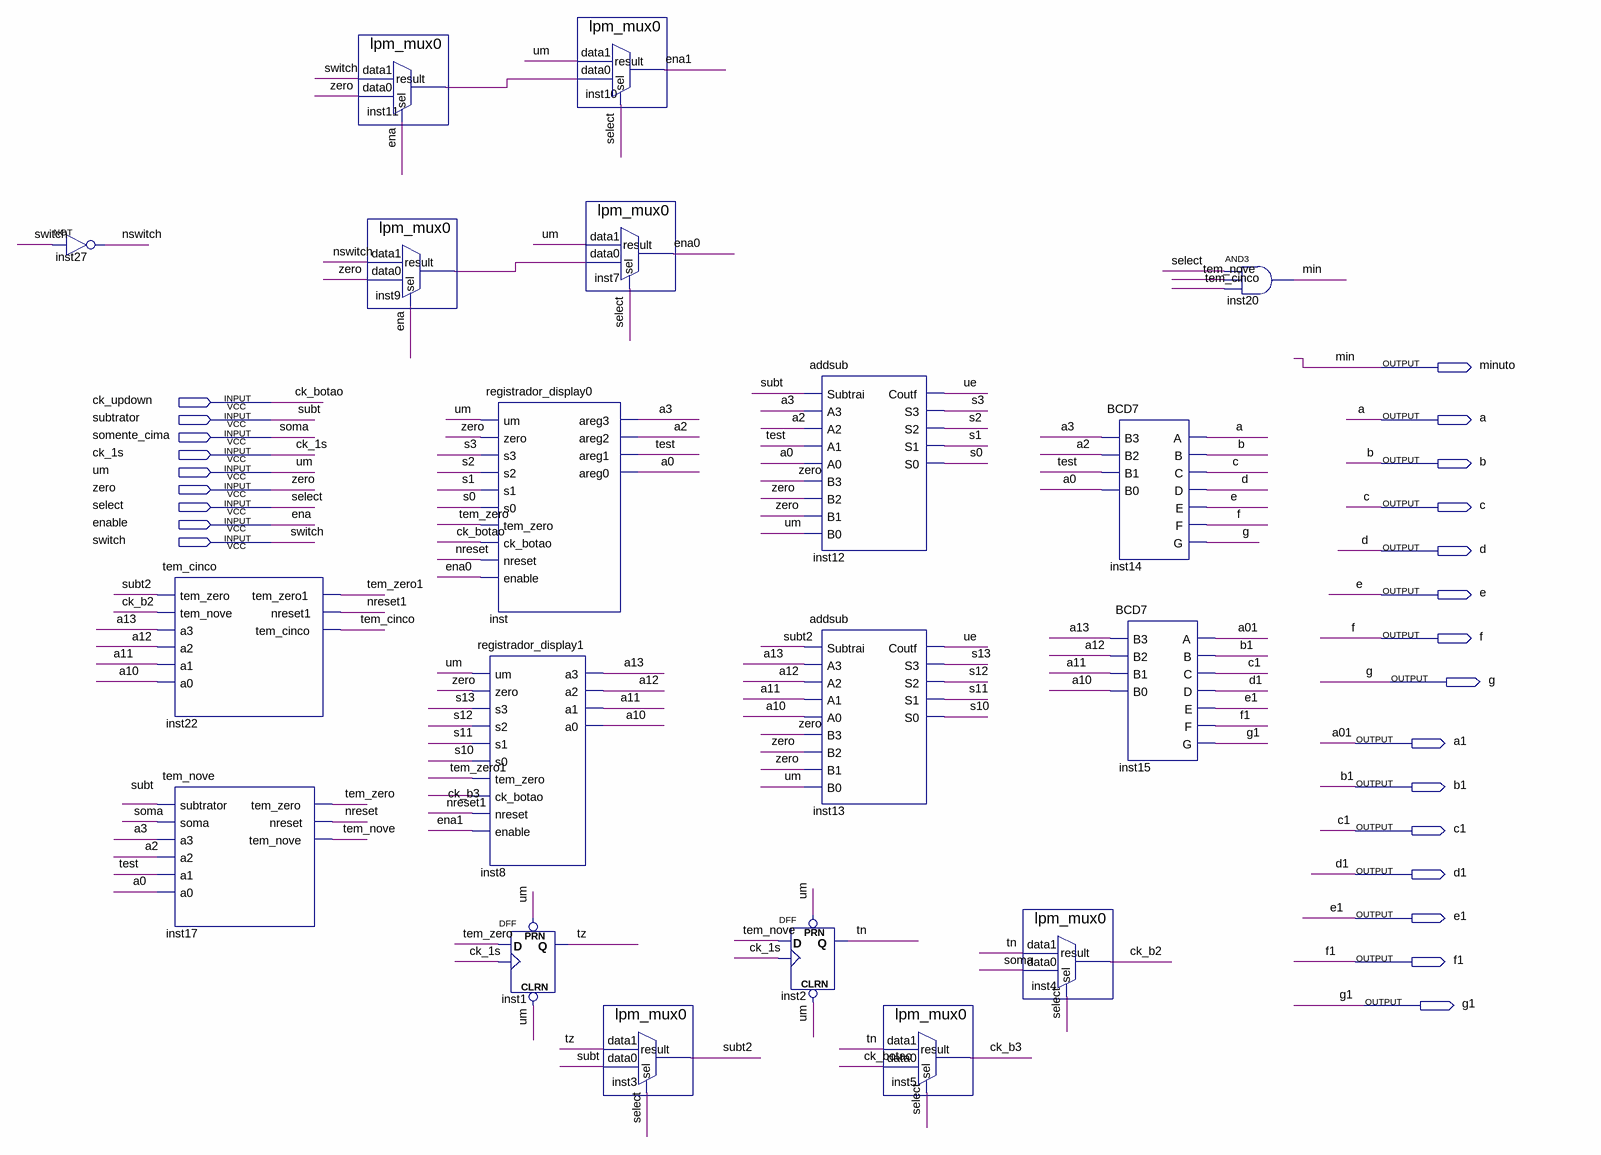
[diagram p0: schematic sheet]
// Quartus schematic display_segundos.bdf as structural Verilog: 19 symbols, 24 pins
module display_segundos (
  input  ck_updown,
  input  subtrator,
  input  somente_cima,
  input  ck_1s,
  input  um,
  input  zero,
  input  select,
  input  enable,
  input  switch,
  output minuto,
  output a,
  output b,
  output c,
  output d,
  output e,
  output f,
  output g,
  output a1,
  output b1,
  output c1,
  output d1,
  output e1,
  output f1,
  output g1
);

  wire a0, a2, a3, a10, a11, a12, a13, ck_b2, ck_b3, ena0, ena1, inst9_result, inst11_result, nreset,
       nreset1, nswitch, s0, s1, s2, s3, s10, s11, s12, s13, subt2, tem_cinco, tem_nove, tem_zero, tem_zero1,
       test, tn, tz, ue;

  not inst27 (nswitch, switch);
  tem_cinco inst22 (
    .tem_zero(subt2), .tem_nove(ck_b2), .a3(a13), .a2(a12), .a1(a11), .a0(a10), .tem_zero1(tem_zero1),
    .nreset1(nreset1), .tem_cinco(tem_cinco));
  tem_nove inst17 (
    .subtrator(subtrator), .soma(somente_cima), .a3(a3), .a2(a2), .a1(test), .a0(a0), .tem_zero(tem_zero),
    .nreset(nreset), .tem_nove(tem_nove));
  lpm_mux0 inst11 (.data1(switch), .data0(zero), .sel(enable), .result(inst11_result));
  lpm_mux0 inst9 (.data1(nswitch), .data0(zero), .sel(enable), .result(inst9_result));
  registrador_display0 inst (
    .um(um), .zero(zero), .s3(s3), .s2(s2), .s1(s1), .s0(s0), .tem_zero(tem_zero), .ck_botao(ck_updown),
    .nreset(nreset), .enable(ena0), .areg3(a3), .areg2(a2), .areg1(test), .areg0(a0));
  registrador_display1 inst8 (
    .um(um), .zero(zero), .s3(s13), .s2(s12), .s1(s11), .s0(s10), .tem_zero(tem_zero1), .ck_botao(ck_b3),
    .nreset(nreset1), .enable(ena1), .a3(a13), .a2(a12), .a1(a11), .a0(a10));
  DFF inst1 (.CLRN(um), .CLK(ck_1s), .D(tem_zero), .PRN(um), .Q(tz));
  lpm_mux0 inst10 (.data1(um), .data0(inst11_result), .sel(select), .result(ena1));
  lpm_mux0 inst7 (.data1(um), .data0(inst9_result), .sel(select), .result(ena0));
  lpm_mux0 inst3 (.data1(tz), .data0(subtrator), .sel(select), .result(subt2));
  addsub inst12 (
    .Subtrai(subtrator), .A3(a3), .A2(a2), .A1(test), .A0(a0), .B3(zero), .B2(zero), .B1(zero), .B0(um),
    .Coutf(ue), .S3(s3), .S2(s2), .S1(s1), .S0(s0));
  addsub inst13 (
    .Subtrai(subt2), .A3(a13), .A2(a12), .A1(a11), .A0(a10), .B3(zero), .B2(zero), .B1(zero), .B0(um),
    .Coutf(ue), .S3(s13), .S2(s12), .S1(s11), .S0(s10));
  DFF inst2 (.CLRN(um), .CLK(ck_1s), .D(tem_nove), .PRN(um), .Q(tn));
  lpm_mux0 inst5 (.data1(tn), .data0(ck_updown), .sel(select), .result(ck_b3));
  lpm_mux0 inst4 (.data1(tn), .data0(somente_cima), .sel(select), .result(ck_b2));
  BCD7 inst14 (.B3(a3), .B2(a2), .B1(test), .B0(a0), .A(a), .B(b), .C(c), .D(d), .E(e), .F(f), .G(g));
  BCD7 inst15 (.B3(a13), .B2(a12), .B1(a11), .B0(a10), .A(a1), .B(b1), .C(c1), .D(d1), .E(e1), .F(f1), .G(g1));
  and inst20 (minuto, select, tem_nove, tem_cinco);

  // Other names for the same wires on the sheet: a01 = a1; ck_botao = ck_updown; ena = enable; min = minuto;
  //   soma = somente_cima; subt = subtrator
endmodule
